# Altium schematic sheet MCU.SchDoc
size A4
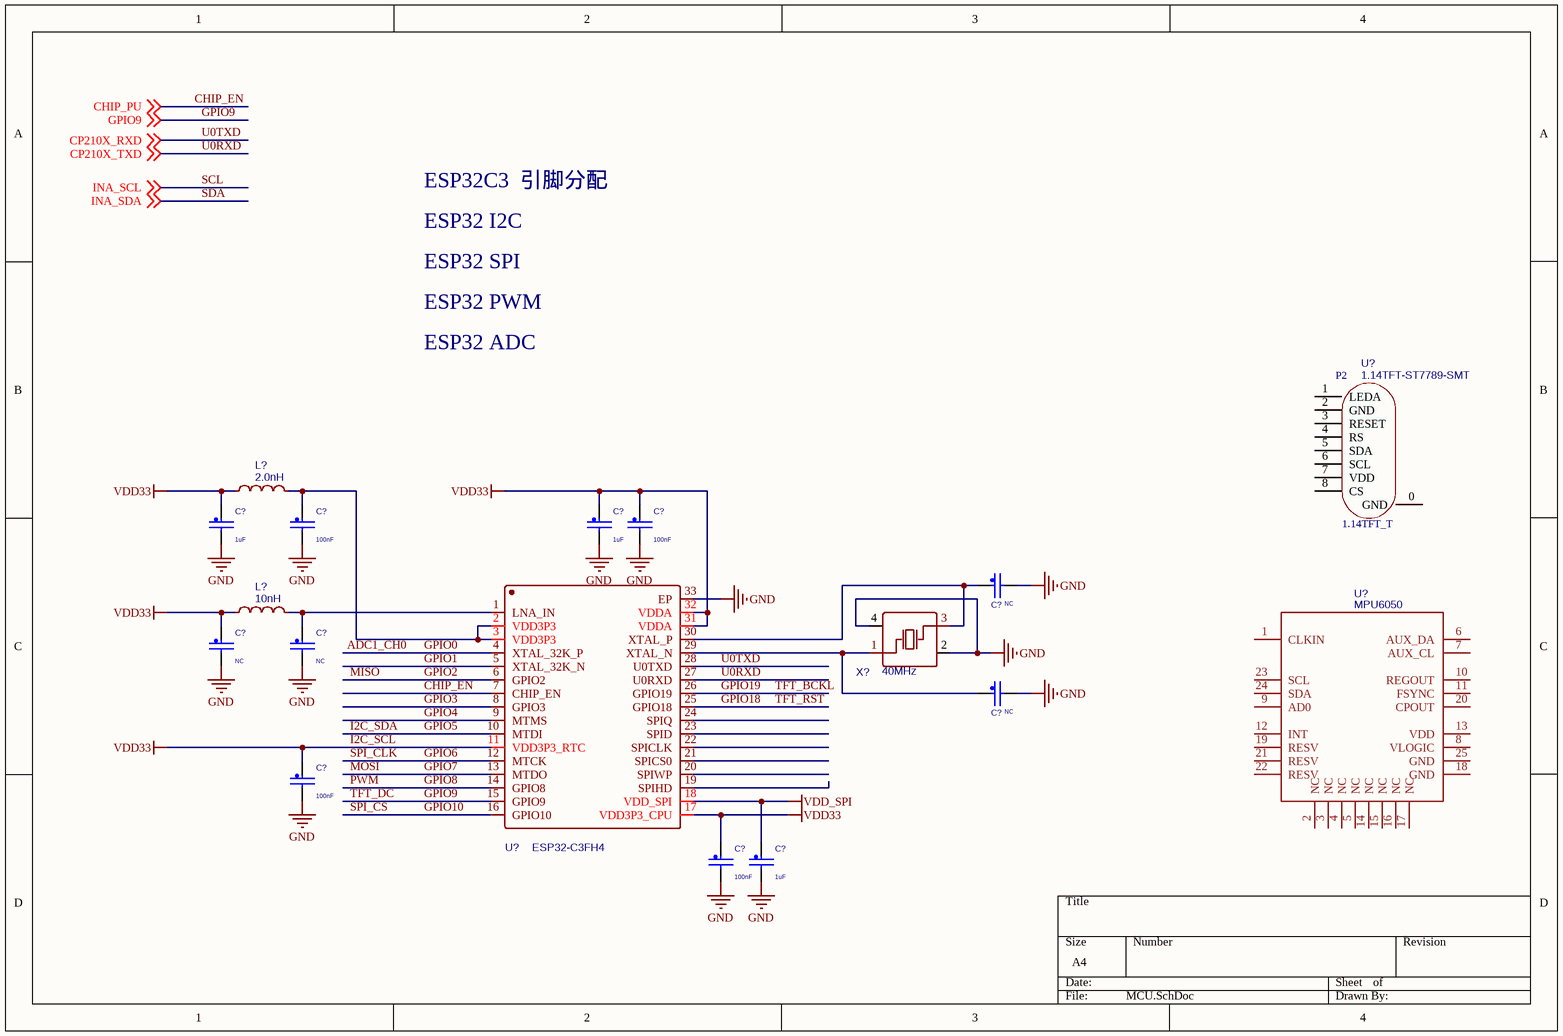
[diagram p0: MCU.SchDoc]

## Parts
(Parts that share a designator on the sheet are numbered #1, #2 ... from top to bottom, then left to right.)
C?#1  1uF  [C0603]
C?#2  100nF  [C0603]
C?#3  1uF  [C0603]
C?#4  100nF  [C0603]
C?#5  NC  [C0603]
C?#6  NC  [C0603]
C?#7  NC  [C0603]
C?#8  NC  [C0603]
C?#9  100nF  [C0603]
C?#10  100nF  [C0603]
C?#11  1uF  [C0603]
L?#1  2.0nH  [L0402]
L?#2  10nH  [L0402]
U?#1  1.14TFT-ST7789-SMT  [1.14TFT-ST7789-SMT]
U?#2  ESP32-C3FH4  [QFN-32_L5.0-W5.0-P0.50-TL-EP3.7]
U?#3  MPU6050  [QFN50P400X400X95-25T265X275N]
X?  40MHz  [CRYSTAL-SMD_4P-L5.0-W3.2-BL]

## Nets
GND: C?#1.2 C?#2.2 C?#3.2 C?#4.2 C?#5.2 C?#6.2 C?#7.2 C?#8.2 C?#9.2 C?#10.2 C?#11.2 U?#2.33(EP) X?.2(GND) X?.4(GND)
I2C_SCL: C?#1.1 C?#3.1 C?#4.1 C?#6.1 C?#9.1 C?#10.1 L?#1.1 L?#2.1 U?#2.11(VDD3P3_RTC) U?#2.17(VDD3P3_CPU) U?#2.31(VDDA) U?#2.32(VDDA)  [also labelled VDD33]
VDD_SPI: C?#11.1 U?#2.18(VDD_SPI)
ADC1_CH0: U?#2.4(XTAL_32K_P)  [also labelled GPIO0]
CHIP_EN: U?#2.7(CHIP_EN) ; off-sheet CHIP_PU  [also labelled CHIP_PU]
GPIO1: U?#2.5(XTAL_32K_N)
GPIO2: U?#2.6(GPIO2)  [also labelled MISO]
GPIO3: U?#2.8(GPIO3)
GPIO4: U?#2.9(MTMS)
GPIO5: U?#2.10(MTDI)  [also labelled I2C_SDA]
GPIO6: U?#2.12(MTCK)  [also labelled SPI_CLK]
GPIO7: U?#2.13(MTDO)  [also labelled MOSI]
GPIO8: U?#2.14(GPIO8)  [also labelled PWM]
GPIO9: U?#2.15(GPIO9) ; off-sheet GPIO9  [also labelled TFT_DC]
GPIO10: U?#2.16(GPIO10)  [also labelled SPI_CS]
GPIO18: U?#2.25(GPIO18)  [also labelled TFT_RST]
GPIO19: U?#2.26(GPIO19)  [also labelled TFT_BCKL]
U0RXD: U?#2.27(U0RXD) ; off-sheet CP210X_TXD  [also labelled CP210X_TXD]
U0TXD: U?#2.28(U0TXD) ; off-sheet CP210X_RXD  [also labelled CP210X_RXD]
NetC?#2_1: C?#2.1 L?#1.2 U?#2.2(VDD3P3) U?#2.3(VDD3P3)
NetC?#5_1: C?#5.1 U?#2.30(XTAL_P) X?.3(OSC2)
NetC?#7_1: C?#7.1 L?#2.2 U?#2.1(LNA_IN)
NetC?#8_1: C?#8.1 U?#2.29(XTAL_N) X?.1(OSC1)

Not connected (* = marked no-connect by the designer): U?#1 0(GND) 1(LEDA) 2(GND) 3(RESET) 4(RS) 5(SDA) 6(SCL) 7(VDD) 8(CS); U?#2 19(SPIHD) 20(SPIWP) 21(SPICS0) 22(SPICLK) 23(SPID) 24(SPIQ); U?#3 1(CLKIN) 2(NC) 3(NC) 4(NC) 5(NC) 6(AUX_DA) 7(AUX_CL) 8(VLOGIC) 9(AD0) 10(REGOUT) 11(FSYNC) 12(INT) 13(VDD) 14(NC) 15(NC) 16(NC) 17(NC) 18(GND) 19(RESV) 20(CPOUT) 21(RESV) 22(RESV) 23(SCL) 24(SDA) 25(GND)

## Notes on the sheet
- ESP32 I2C
- ESP32C3  引脚分配
- ESP32 SPI
- ESP32 PWM
- ESP32 ADC
- (in symbol 1.14TFT-ST7789-SMT) P2; 1.14TFT_T

## Library data of the parts
C?#1-C?#11 = CAP_NP: CAP CER 22UF 6.3V 20% X5R 0603; CLASS: DISCRETE; AGILE_PN: 150-78467; MFG_NAME01: Samsung; MFG_PN01: CL10A226MQ8NRNE; CAD_APPROVED: Yes; FPLIST: CC0603_OV,CC0603,0603_CC; voltage rating: 6.3V; Tolerance: 20%; ROHS: Yes; HEIGHT: 1MM; VOLTAGE: 6.3V
L?#1 L?#2 = 10nH: BOM_Manufacturer: MuRata; BOM_Manufacturer Part: LQW15AN10NG00D; nameAlias: Inductance; BOM_Supplier: LCSC; BOM_Supplier Part: C90642; BOM_JLCPCB Part Class: Extended Part; spicePre: L; spiceSymbolName: LQW15AN10NG00D
U?#1 = 1.14TFT-ST7789-SMT: Contributor: yanwudi; spicePre: U; spiceSymbolName: 1.14TFT-ST7789-SMT
U?#2 = ESP32-C3FH4: BOM_Manufacturer: ESPRESSIF 乐鑫; Contributor: dztdzt; BOM_Supplier: LCSC; BOM_Supplier Part: C2858491; BOM_Manufacturer Part: ESP32-C3FH4; spicePre: U; spiceSymbolName: ESP32-C3FH4
X? = 40MHz: BOM_Manufacturer: TAITIEN Elec; BOM_Manufacturer Part: XVHEELNANF-40MHZ; nameAlias: Frequency; Contributor: LCSC; BOM_Supplier: LCSC; BOM_Supplier Part: C295530; BOM_JLCPCB Part Class: Extended Part; spicePre: X; spiceSymbolName: XVHEELNANF-40MHZ
U?#3 = MPU6050: spicePre: U; spiceSymbolName: MPU6050